# EAGLE design LightGateBoard (EAGLE 9.6.2)
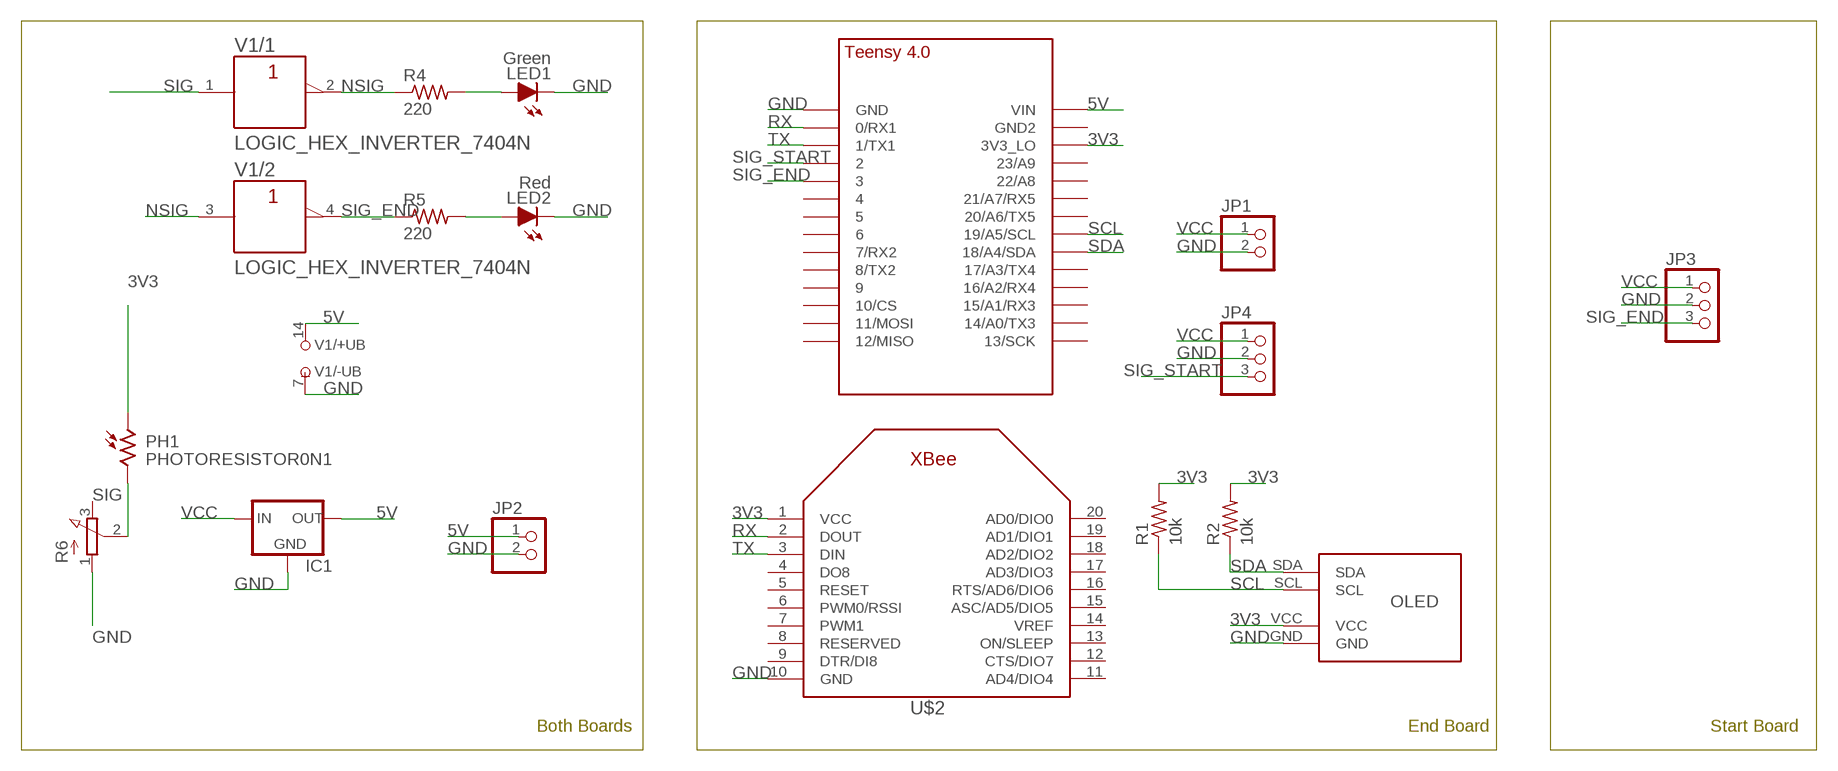
[diagram p0: schematic, sheet 1]

## Parts
IC1  REG_5V_L7805_HOR  [TO-220-H]
JP1  PINHD-1X2  [1X02]
JP2  PINHD-1X2  [1X02]
JP3  PINHD-1X3  [1X03]
JP4  PINHD-1X3  [1X03]
LED1  Green  LED-5MM  [LED-5MM]
LED2  Red  LED-5MM  [LED-5MM]
PH1  PHOTORESISTOR0N1  [TO46-VT200]
R1  10k  RES_AXIAL1/4W-0.3  [1/4W-0.3]
R2  10k  RES_AXIAL1/4W-0.3  [1/4W-0.3]
R4  220  RES_AXIAL1/4W-0.3  [1/4W-0.3]
R5  220  RES_AXIAL1/4W-0.3  [1/4W-0.3]
R6  POTENTIOMETER  [3RP/1610N]
U$1  TEENSY_4.0_SIMPLE  [TEENSY_4.0_SIMPLE]
U$2  XBEE  [XBEE]
U$3  OLED_SSD1306  [OLED_SSD1306]
V1  LOGIC_HEX_INVERTER_7404N  [DIL14]

## Nets
3V3: PH1.1 R1.2 R2.2 U$1.3V3_LO U$2.1(VCC) U$3.VCC
5V: IC1.3(OUT) JP2.1 U$1.VIN V1.14(/+UB:+UB)
GND: IC1.2(GND) JP1.2 JP2.2 JP3.2 JP4.2 LED1.K(C) LED2.K(C) R6.1(A) U$1.GND U$2.10(GND) U$3.GND V1.7(/-UB:-UB)
N$1: LED1.A R4.2
N$7: LED2.A R5.2
NSIG: R4.1 V1.2(/1:Y) V1.3(/2:A)
RX: U$1.0/RX(0/RX1) U$2.2(DOUT)
SCL: R1.1 U$1.19/A5/SCL U$3.SCL
SDA: R2.1 U$1.18/A4/SDA U$3.SDA
SIG: PH1.2 R6.2(S) V1.1(/1:A)
SIG_END: JP3.3 R5.1 U$1.3/CANTX V1.4(/2:Y)
SIG_START: JP4.3 U$1.2
TX: U$1.1/TX(1/TX1) U$2.3(DIN)
VCC: IC1.1(IN) JP1.1 JP3.1 JP4.1
Unconnected: R6.3(E) U$1.4/CANRX U$1.5 U$1.6 U$1.7(7/RX2) U$1.8(8/TX2) U$1.9/CS U$1.10/CS U$1.11/MOSI U$1.12/MISO U$1.13/SCK U$1.14/A0(14/A0/TX3) U$1.15/A1(15/A1/RX3) U$1.16/A2(16/A2/RX4) U$1.17/A3(17/A3/TX4) U$1.20/A6(20/A6/TX5) U$1.21/A7(21/A7/RX5) U$1.22/A8 U$1.23/A9 U$1.GND2 U$2.4(DO8) U$2.5(RESET) U$2.6(PWM0/RSSI) U$2.7(PWM1) U$2.8(RESERVED) U$2.9(DTR/DI8) U$2.11(AD4/DIO4) U$2.12(CTS/DIO7) U$2.13(ON/SLEEP) U$2.14(VREF) U$2.15(ASC/AD5/DIO5) U$2.16(RTS/AD6/DIO6) U$2.17(AD3/DIO3) U$2.18(AD2/DIO2) U$2.19(AD1/DIO1) U$2.20(AD0/DIO0) V1.5(/3:A) V1.6(/3:Y) V1.8(/4:Y) V1.9(/4:A) V1.10(/5:Y) V1.11(/5:A) V1.12(/6:Y) V1.13(/6:A)

## Notes on the sheet
- Both Boards | End Board | Start Board

## Library data of the parts
IC1 = 1-Active Components:REG_5V_L7805: Voltage Regulator Switching 5v regulator Datasheet <http://power.murata.com/data/power/oki-78sr.pdf> Standard 7805 5V regulator. IGO (Input Ground Output). Spark Fun Electronics SKU : COM-00107 Datasheet <http://www.mouser.com/ds/2/308/MC7800-D-94905.pdf>
JP1 JP2 = 1-Connectors:PINHD-1X2: PIN HEADER
JP3 JP4 = 1-Connectors:PINHD-1X3: PIN HEADER
LED1 LED2 = 1-Passive Components:LED: Light Emitting Diode (LED) Source: Dangerous Prototypes Eagle Library <https://github.com/DangerousPrototypes/Eagle_Part_Library>
PH1 = GTOR - Passive Components:PHOTORESISTOR: Photoconductive Cell VT200 Series Source: http://optoelectronics.perkinelmer.com/content/Datasheets/DTS_vt200seriesdatasheet.pdf
R1 R2 R4 R5 = 1-Passive Components:RES_AXIAL: RESISTOR, American symbol; SPICEPREFIX: R
R6 = GTOR - Passive Components:POTENTIOMETER: 16mm Potentiometer one level Source: http://www.alphapotentiometers.net/html/16mm_pot_2.html
U$1 = 1-Microcontroller:TEENSY_4.0_SIMPLE
U$2 = 1-Microcontroller:XBEE: Source: Adafruit <https://github.com/adafruit/Adafruit-Eagle-Library>
U$3 = 1-Breakout Boards:OLED_SSD1306
V1 = 1-Active Components:LOGIC_HEX_INVERTER_7404: Hex INVERTER

## Board
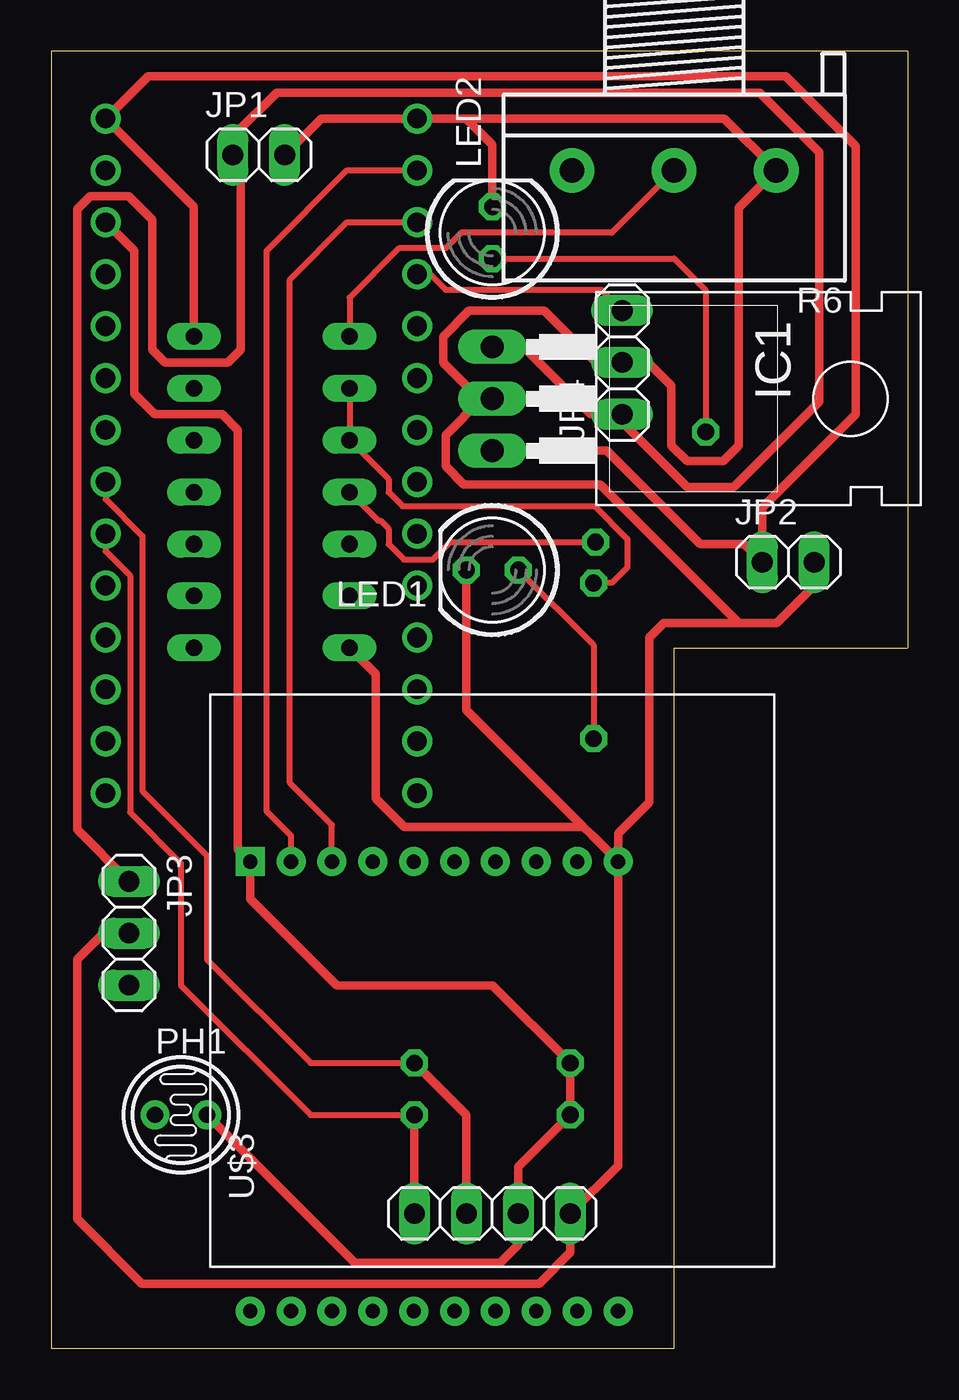
[diagram p1: board, top side]
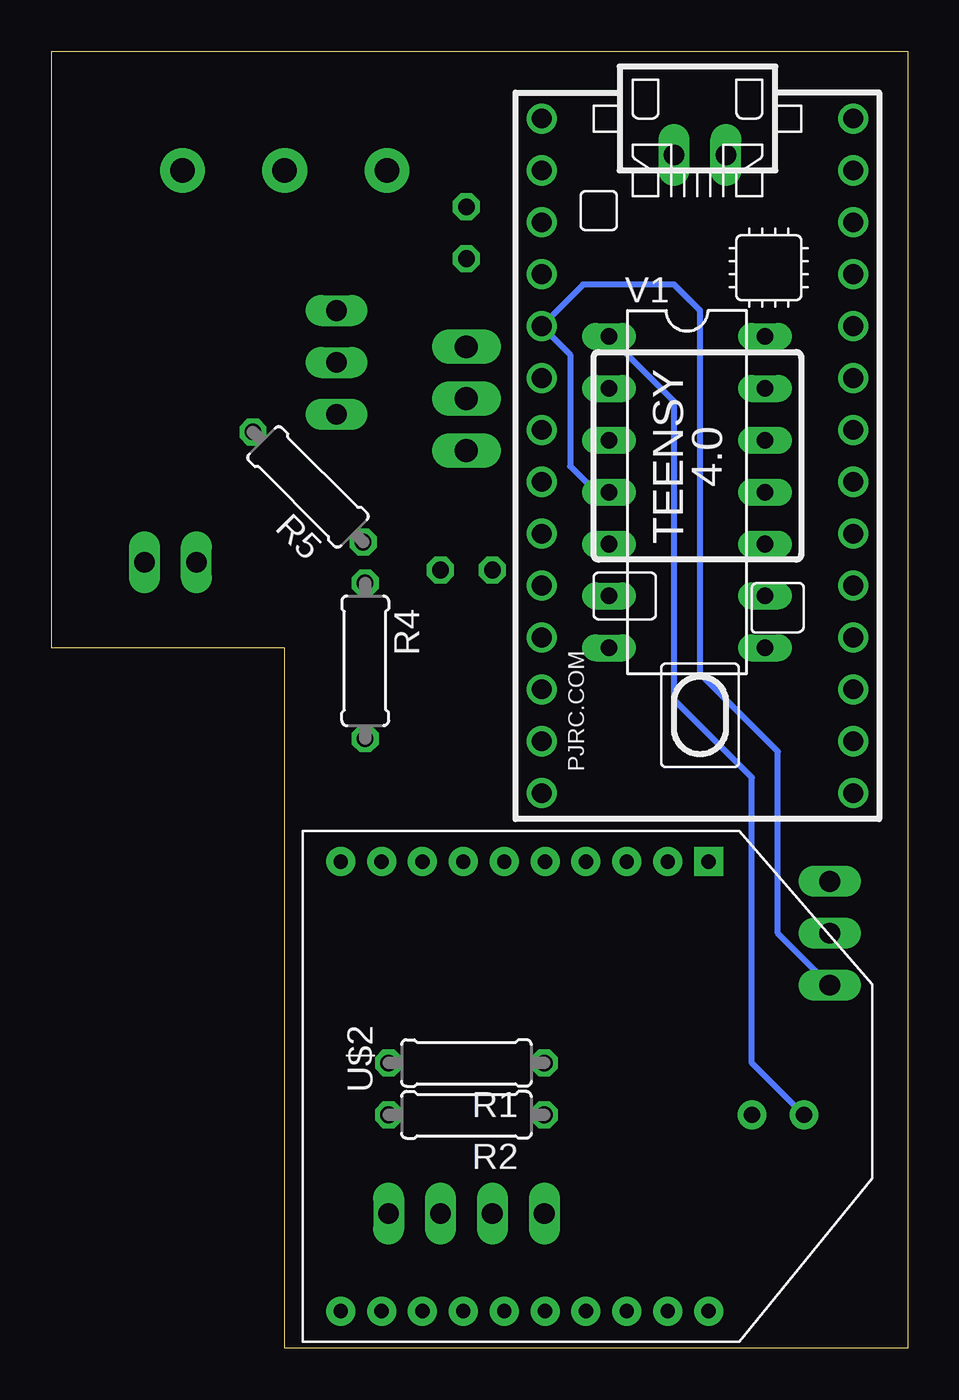
[diagram p2: board, bottom side, seen from below]

Size 41.91 x 63.5 mm. Coordinates in mm from the lower left corner, seen from the top.
Outline: 0,0 30.48,0 30.48,34.29 41.91,34.29 41.91,63.5 0,63.5 0,0
Copper layers (1*16): Top 0.035mm / dielectric 1.5mm / Bottom 0.035mm
Design rules "default *": minimum track width 10mil, minimum drill 0.35mm, track to track 12mil, track to pad 12mil, pad to pad 12mil, via to via 12mil, smd to smd 12mil, copper to edge 40mil, drill to drill 12mil, minimum pad ring 10mil, minimum via ring 8mil, stop-mask expansion 4mil, vias tented up to drill 0mil, thermal gap 10mil

### Footprints (pad centres in the part's own frame; a part is rotated, then mirrored left to right if it is on the bottom)
TO-220-H = drill 1.118 long: 1 -2.54,-6.35; 2 0,-6.35; 3 2.54,-6.35
1X02 = drill 1.016 long: 1 -1.27,0; 2 1.27,0
1X03 = drill 1.016 long: 1 -2.54,0; 2 0,0; 3 2.54,0
LED-5MM = drill 0.813 octagon: A -1.27,0; K 1.27,0
TO46-VT200 = drill 0.8 pad 1.4: 1 -1.27,0; 2 1.27,0
1/4W-0.3 = drill 0.813 octagon: 1 -3.81,0; 2 3.81,0
3RP/1610N = drill 1.2 pad 2.184: 1 -5,0; 2 0,0; 3 5,0
TEENSY_4.0_SIMPLE = drill 0.965: 0/RX -13.97,-7.62; 1/TX -11.43,-7.62; 2 -8.89,-7.62; 3/CANTX -6.35,-7.62; 3V3_LO -11.43,7.62; 4/CANRX -3.81,-7.62; 5 -1.27,-7.62; 6 1.27,-7.62; 7 3.81,-7.62; 8 6.35,-7.62; 9/CS 8.89,-7.62; 10/CS 11.43,-7.62; 11/MOSI 13.97,-7.62; 12/MISO 16.51,-7.62; 13/SCK 16.51,7.62; 14/A0 13.97,7.62; 15/A1 11.43,7.62; 16/A2 8.89,7.62; 17/A3 6.35,7.62; 18/A4/SDA 3.81,7.62; 19/A5/SCL 1.27,7.62; 20/A6 -1.27,7.62; 21/A7 -3.81,7.62; 22/A8 -6.35,7.62; 23/A9 -8.89,7.62; GND -16.51,-7.62; GND2 -13.97,7.62; VIN -16.51,7.62
XBEE = drill 0.7 pad 1.422 square: 1 -11,5.5 | drill 0.7 pad 1.422: 2 -11,3.5; 3 -11,1.5; 4 -11,-0.5; 5 -11,-2.5; 6 -11,-4.5; 7 -11,-6.5; 8 -11,-8.5; 9 -11,-10.5; 10 -11,-12.5; 11 11,-12.5; 12 11,-10.5; 13 11,-8.5; 14 11,-6.5; 15 11,-4.5; 16 11,-2.5; 17 11,-0.5; 18 11,1.5; 19 11,3.5; 20 11,5.5
OLED_SSD1306 = drill 1.016 long: GND 0,-3.81; SCL 0,1.27; SDA 0,3.81; VCC 0,-1.27
DIL14 = drill 0.813 long: 1 -7.62,-3.81; 2 -5.08,-3.81; 3 -2.54,-3.81; 4 0,-3.81; 5 2.54,-3.81; 6 5.08,-3.81; 7 7.62,-3.81; 8 7.62,3.81; 9 5.08,3.81; 10 2.54,3.81; 11 0,3.81; 12 -2.54,3.81; 13 -5.08,3.81; 14 -7.62,3.81

### Placement (x,y rotation side)
IC1  27.94,46.48 270 top
JP1  10.16,58.42 0 top
JP2  36.07,38.48 0 top
JP3  3.81,20.32 270 top
JP4  27.94,48.26 90 top
LED1  21.59,38.1 180 top
LED2  21.59,54.61 90 top
PH1  6.35,11.43 180 top
R1  21.59,13.97 180 bottom
R2  21.59,11.43 180 bottom
R4  26.54,33.66 270 bottom
R5  29.34,42.16 135 bottom
R6  30.48,57.66 180 top
U$1  10.29,43.69 270 bottom
U$2  15.24,12.83 270 bottom
U$3  21.59,6.6 90 top
V1  10.79,41.91 270 bottom

### Tracks (layer width: path | path; a pad name or v marks a point on that pad's centre or on a via)
3V3
  Top 0.406: PH1.1 14.86,4.19 21.97,4.19 22.86,5.08 U$3.VCC 22.86,8.89 R2.2 R1.2 21.59,17.78 13.97,17.78 9.74,22.01 U$2.1 9.14,24.42 9.14,44.96 8.38,45.72 5.08,45.72 4.06,46.74 4.06,53.72 U$1.3V3_LO
5V
  Top 0.406: V1.14 6.99,55.88 U$1.VIN 4.75,62.28 35.94,62.28 39.37,58.85 39.37,45.72 34.8,41.15 JP2.1 33.91,39.37 31.75,39.37 27.18,43.94 IC1.3
GND
  Top 0.406: JP3.2 2.54,20.32 1.27,19.05 1.27,6.35 4.45,3.17 23.88,3.17 25.4,4.7 U$3.GND 27.74,8.94 U$2.10 | JP1.2 13.21,60.2 U$1.GND 20.32,60.2 | U$2.10 27.74,25.2 29.26,26.72 29.26,34.8 29.98,35.51 33.66,35.51 | 33.66,35.51 35.51,35.51 37.34,37.34 JP2.2 | 20.32,60.2 32.94,60.2 R6.1 33.66,55.83 33.66,44.2 32.89,43.43 31.11,43.43 30.35,44.2 30.35,47.12 29.21,48.26 JP4.2 26.67,48.26 24.13,50.8 20.45,50.8 19.18,49.53 19.18,48.26 20.95,46.48 IC1.2 21.08,46.48 19.3,44.7 19.3,43.18 20.19,42.29 26.87,42.29 33.66,35.51 | 20.32,60.2 21.59,58.93 LED2.K | V1.7 15.88,33.02 15.88,26.92 17.27,25.53 26.04,25.53 | 26.04,25.53 26.42,25.15 U$2.10 | 26.04,25.53 20.32,31.25 LED1.K
N$1
  Top 0.305: LED1.A 26.54,34.42 R4.2
N$7
  Top 0.305: R5.2 32.03,51.79 30.48,53.34 LED2.A
NSIG
  Top 0.305: V1.2 V1.3 16.51,42.55 16.51,41.91 17.2,41.22 26.59,41.22 28.19,39.62 28.19,38.23 27.43,37.47 R4.1
RX
  Top 0.305: U$2.2 11.74,25.09 10.54,26.29 10.54,53.72 14.48,57.66 U$1.0/RX
SCL
  Top 0.305: U$1.19/A5/SCL 2.67,41.57 4.47,39.76 4.47,27.28 7.62,24.13 7.62,19.05 12.7,13.97 R1.1
  Top 0.406: R1.1 20.32,11.43 U$3.SCL
SDA
  Top 0.305: U$1.18/A4/SDA 2.67,39.03 3.86,37.83 3.86,26.24 6.35,23.75 6.35,17.78 12.7,11.43 R2.1
  Top 0.406: U$3.SDA R2.1
SIG
  Top 0.305: R6.2 27.43,54.61 20.07,54.61 19.3,53.85 17.02,53.85 14.61,51.44 V1.1
  Bottom 0.305: PH1.2 7.62,13.97 7.62,27.94 11.43,31.75 11.43,46.35 V1.1
SIG_END
  Top 0.305: V1.4 16,40.51 16.13,40.51 16.51,40.13 16.51,39.37 17.27,38.61 18.67,38.61 19.53,39.47 R5.1
  Bottom 0.305: JP3.3 6.35,20.32 6.35,29.21 10.16,33.02 10.16,50.8 11.43,52.07 15.88,52.07 U$1.3/CANTX 16.51,48.64 16.51,43.18 15.24,41.91 V1.4
SIG_START
  Top 0.305: U$1.2 18.54,52.58 19.3,51.82 26.92,51.82 JP4.3
TX
  Top 0.305: U$2.3 13.74,25.63 11.68,27.69 11.68,52.32 14.48,55.12 U$1.1/TX
VCC
  Top 0.406: JP3.1 1.27,25.4 1.27,55.75 1.91,56.39 3.81,56.39 4.95,55.24 4.95,48.9 5.59,48.26 8.64,48.26 9.27,48.9 9.27,58.04 JP1.1 8.89,59.33 11.03,61.47 34.67,61.47 37.59,58.55 37.59,46.35 33.4,42.16 31.11,42.16 27.94,45.34 JP4.1 26.42,45.72 23.11,49.02 IC1.1